# Altium schematic sheet TopSheet.SchDoc
size A4
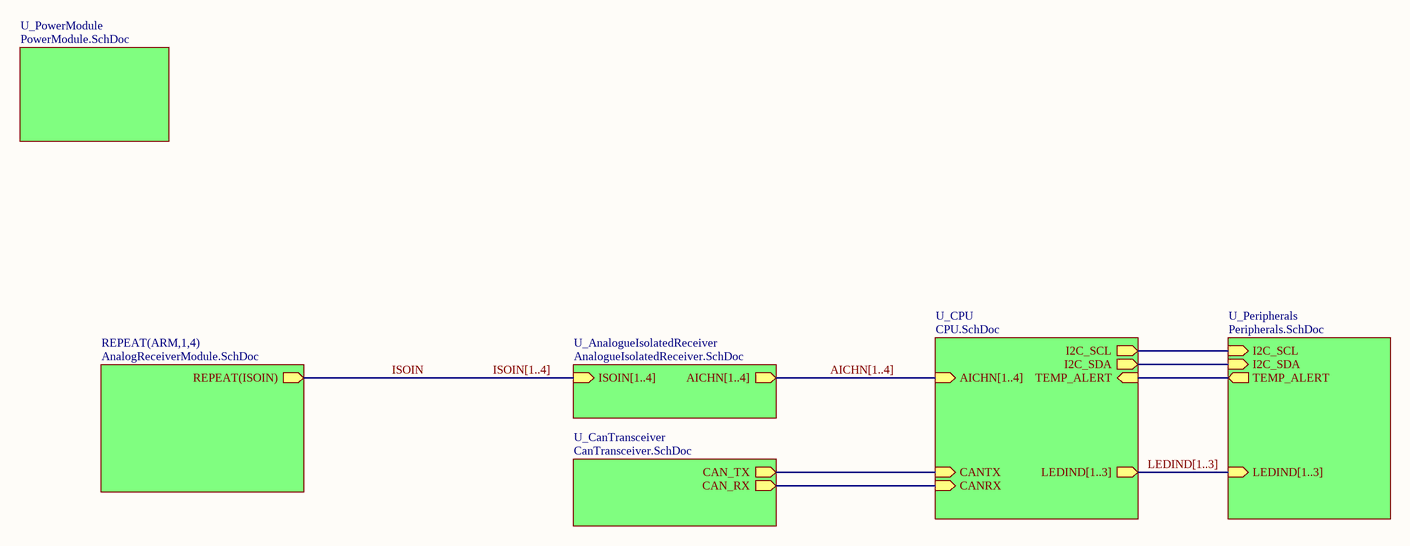
[diagram p0: TopSheet.SchDoc]

## Sub-sheets
REPEAT(ARM,1,4) = AnalogReceiverModule.SchDoc: REPEAT(ISOIN) (out)
U_AnalogueIsolatedReceiver = AnalogueIsolatedReceiver.SchDoc: ISOIN[1..4] (in), AICHN[1..4] (out)
U_CanTransceiver = CanTransceiver.SchDoc: CAN_RX (out), CAN_TX (out)
U_CPU = CPU.SchDoc: CANTX (in), CANRX (in), AICHN[1..4] (in), I2C_SCL (out), I2C_SDA (out), TEMP_ALERT (in), LEDIND[1..3] (out)
U_Peripherals = Peripherals.SchDoc: I2C_SCL (in), TEMP_ALERT (out), I2C_SDA (in), LEDIND[1..3] (in)
U_PowerModule = PowerModule.SchDoc: no entries

## Nets
ISOIN: sheet REPEAT(ARM,1,4)/REPEAT(ISOIN)
(unnamed): sheet U_CanTransceiver/CAN_RX, sheet U_CPU/CANRX
(unnamed): sheet U_CanTransceiver/CAN_TX, sheet U_CPU/CANTX
(unnamed): sheet U_CPU/I2C_SCL, sheet U_Peripherals/I2C_SCL
(unnamed): sheet U_CPU/I2C_SDA, sheet U_Peripherals/I2C_SDA
(unnamed): sheet U_CPU/TEMP_ALERT, sheet U_Peripherals/TEMP_ALERT

## Buses and harness runs
bus AICHN[1..4] = sheet U_AnalogueIsolatedReceiver/AICHN[1..4] = sheet U_CPU/AICHN[1..4]
bus ISOIN[1..4] = sheet U_AnalogueIsolatedReceiver/ISOIN[1..4]
bus LEDIND[1..3] = sheet U_CPU/LEDIND[1..3] = sheet U_Peripherals/LEDIND[1..3]

## Notes on the sheet
- Title:
- Drawn By:
- Page Contents:
- Checked By:
- Size:
- Date:
- File:
- License:
- Email:
- A4
- Number:
- Time:
- Revision:
- Sheet
- Website:
- of